# Altium schematic sheet TK2560_GSMWiFi.SchDoc
size A4
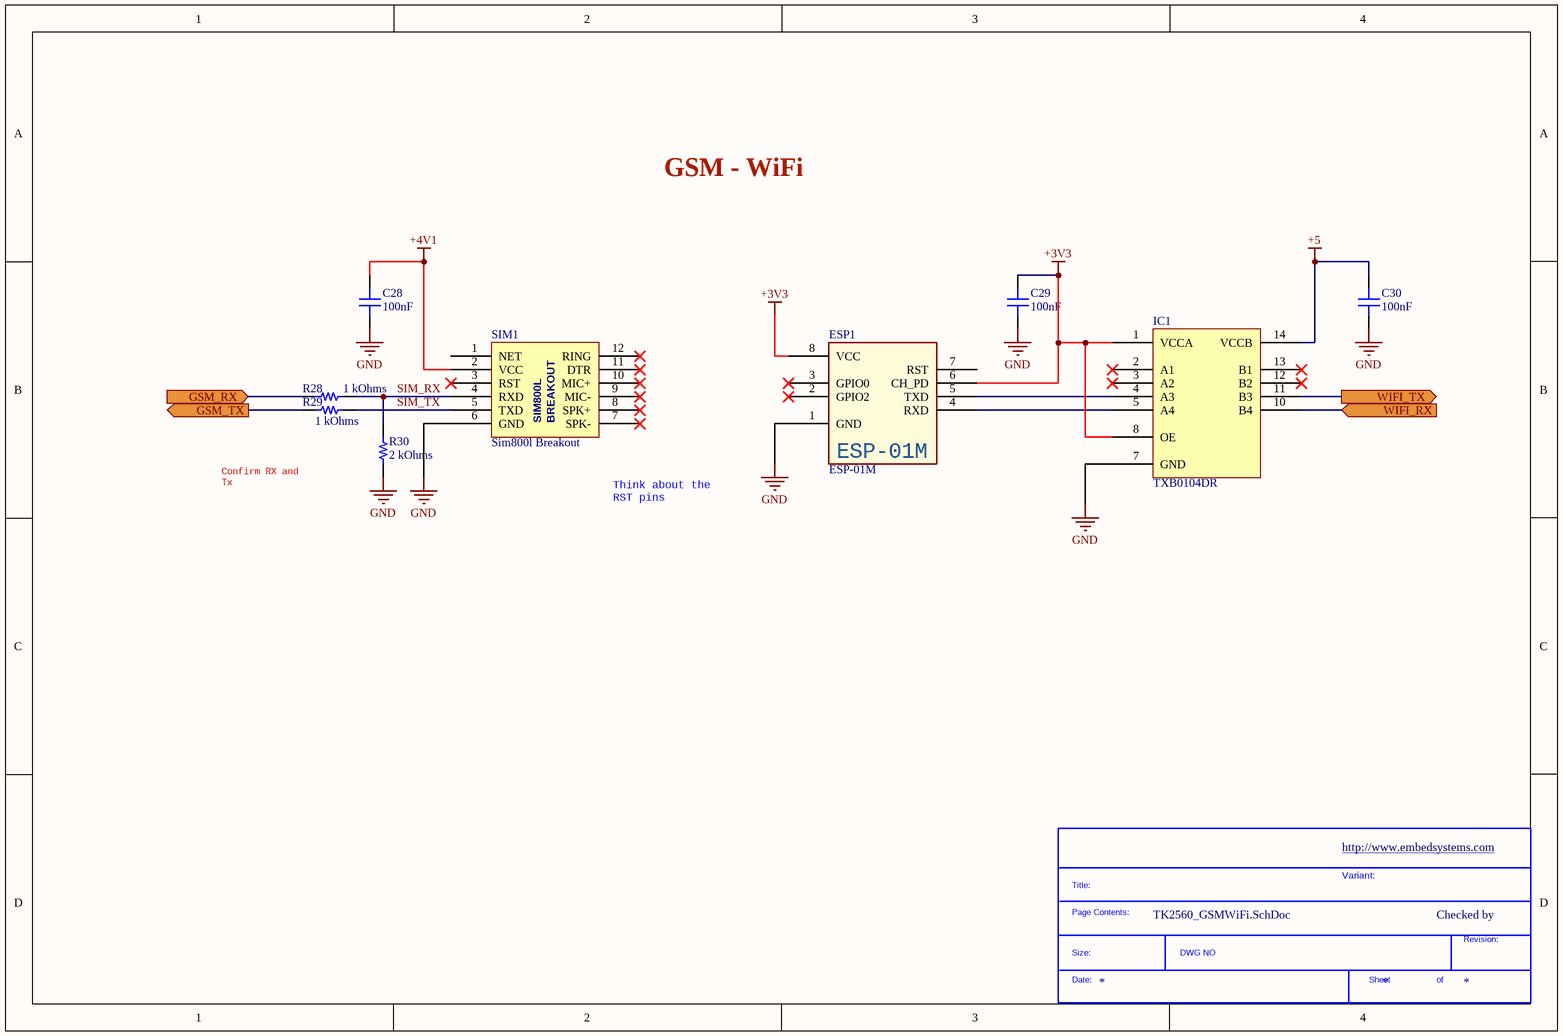
[diagram p0: TK2560_GSMWiFi.SchDoc]

## Parts
*?  SDTitleBlock  (value not drawn)  (graphical)
C28  100nF  [CAP 0805_2012]
C29  100nF  [CAP 0805_2012]
C30  100nF  [CAP 0805_2012]
ESP1  ESP-01M  [ESP-01]
IC1  TXB0104DR  [TI SOIC-14 D]
R28  1 kOhms  [RES 0805_2012]
R29  1 kOhms  [RES 0805_2012]
R30  2 kOhms  [RES 0805_2012]
SIM1  Sim800l Breakout  [SIM800L_BO]

## Ports
GSM_RX (in), GSM_TX (out), WIFI_RX (in), WIFI_TX (out)

## Nets
+3V3: C29.2 ESP1.6(CH_PD) ESP1.8(VCC) IC1.1(VCCA) IC1.8(OE)
+4V1: C28.2 SIM1.2(VCC)
+5: C30.2 IC1.14(VCCB)
GND: C28.1 C29.1 C30.1 ESP1.1(GND) IC1.7(GND) R30.1 SIM1.6(GND)
GSM_RX: R28.1 ; port GSM_RX
GSM_TX: R29.1 ; port GSM_TX
SIM_RX: R28.2 R30.2 SIM1.4(RXD)
SIM_TX: R29.2 SIM1.5(TXD)
WIFI_RX: IC1.10(B4) ; port WIFI_RX
WIFI_TX: IC1.11(B3) ; port WIFI_TX
NetESP1_4: ESP1.4(RXD) IC1.5(A4)
NetESP1_5: ESP1.5(TXD) IC1.4(A3)

Not connected (* = marked no-connect by the designer): ESP1 2(GPIO2)* 3(GPIO0)* 7(RST); IC1 2(A1)* 3(A2)* 12(B2)* 13(B1)*; SIM1 1(NET) 3(RST)* 7(SPK-)* 8(SPK+)* 9(MIC-)* 10(MIC+)* 11(DTR)* 12(RING)*

## Notes on the sheet
- GSM - WiFi
- Confirm RX and Tx
- Think about the RST pins
- http://www.embedsystems.com
- Variant:
- Checked by
- (in symbol SDTitleBlock) Title:; Page Contents:; Revision:; Size:; DWG NO; Date:; Sheet; of
- (in symbol Sim800l Breakout) SIM800L; BREAKOUT

## Library data of the parts
C28-C30 = AC0805KKX8R9BB104: CAP CER 0805 10% X8R 50V 100NF; Manufacturer: Yageo; Capacitance: 0.1µF; Part Number: AC0805KKX8R9BB104; Value: 100nF; Applications: Automotive; ComponentLink1Description: Datasheet; ComponentLink1URL: http://www.yageo.com/documents/recent/AC0805KKX8R9BB104.pdf; ComponentLink2Description: DigiKey Link; ComponentLink2URL: http://digikey.com/product-detail/en/yageo/AC0805KKX8R9BB104/311-4624-1-ND/9699550; Device Package: 0805 (2012 Metric); LastUpdated: 02/09/2020 01:04:20; Lifecycle Status: Active; Minimum Order: 1; Mounting Type: Surface Mount, MLCC; Operating Temperature: -55°C ~ 150°C; Package / Case: 0805 (2012 Metric); Packaging: TapeAndReel; PartId: 14076; Part Status: Active; Price: 0.06; Ratings: AEC-Q200; Series: AC; Size / Dimension: 0.079" L x 0.049" W (2.00mm x 1.25mm); Supplier 1: DigiKey; Supplier Part Number 1: 311-4624-1-ND; Temperature Coefficient: X8R; Thickness (Max): 0.057" (1.45mm); Tolerance: ±10%; Voltage - Rated: 50V
ESP1 = ESP-01M: TXRX ESP8266 MOD WIFI TRACE ANT; Manufacturer: Seeed Studio; Manufacturer Part Number: 317060016; RoHS: No; Category: Embedded Processors and Controllers; Stock 1: 190; Pricing 1: 1=7.09000 (USD); Case/Package: Module; Weight: 0.0625lb; Length: 3.25inch; Width: 2.25inch; Height: 0.25inch; ComponentLink1URL: https://media.digikey.com/pdf/Data%20Sheets/Seeed%20Technology/317060016_Web.pdf?src-supplier=Digi-Key; ComponentLink1Description: https://media.digikey.com/pdf/Data%20Sheets/Seeed%20Technology/317060016_Web.pdf?src-supplier=Digi-Key; Supplier 1: Digi-Key; Supplier Part Number 1: 1597-1145-ND
IC1 = TXB0104DR: IC TRNSLTR BIDIRECTIONAL 14SOIC; Manufacturer: Texas Instruments; Channels per Circuit: 4; Data Rate: 100Mbps; Number of Circuits: 1; Output Type: Tri-State, Non-Inverted; Translator Type: Voltage Level; Voltage - VCCA: 1.2V ~ 3.6V; Voltage - VCCB: 1.65V ~ 5.5V; Part Number: TXB0104DR; Channel Type: Bidirectional; ComponentLink1Description: Datasheet; ComponentLink1URL: http://www.ti.com/general/docs/suppproductinfo.tsp?distId=10&gotoUrl=http%3A%2F%2Fwww.ti.com%2Flit%2Fgpn%2Ftxb0104; ComponentLink2Description: DigiKey Link; ComponentLink2URL: http://digikey.com/product-detail/en/texas-instruments/TXB0104DR/296-21928-1-ND/1629281; Device Package: 14-SOIC (0.154", 3.90mm Width); Features: Auto-Direction Sensing; LastUpdated: 13/05/2020 17:06:13; Lifecycle Status: Active; Minimum Order: 1; Mounting Type: Surface Mount; Operating Temperature: -40°C ~ 85°C (TA); Package / Case: 14-SOIC (0.154", 3.90mm Width); Packaging: TapeAndReel; Part Status: Active; Price: 0.54; Series: -; Supplier 1: DigiKey; Supplier Part Number 1: 296-21928-1-ND; Supplier Device Package: 14-SOIC
R28 R29 = RNCS0805BKE1K00: RES 1K OHM 0.1% 1/10W 0805; Manufacturer: Stackpole Electronics Inc; Power (Watts): 0.1W, 1/10W; Temperature Coefficient: ±25ppm/°C; Part Number: RNCS0805BKE1K00; Value: 1 kOhms; ComponentLink1Description: Datasheet; ComponentLink1URL: https://www.seielect.com/catalog/sei-rncs_rnch.pdf; ComponentLink2Description: DigiKey Link; ComponentLink2URL: http://digikey.com/product-detail/en/stackpole-electronics-inc/RNCS0805BKE1K00/RNCS0805BKE1K00CT-ND/1800170; Composition: Thin Film; Device Package: 0805 (2012 Metric); Features: Anti-Corrosive, Automotive AEC-Q200, Moisture Resistant; Height - Seated (Max): 0.026" (0.65mm); LastUpdated: 02/09/2020 01:15:24; Lifecycle Status: Active; Minimum Order: 1; Number of Terminations: 2; Operating Temperature: -55°C ~ 155°C; Package / Case: 0805 (2012 Metric); Packaging: TapeAndReel; PartId: 27715; Part Status: Active; Price: 0.09; Ratings: AEC-Q200; Resistance: 1 kOhms; Series: RNCS; Size / Dimension: 0.079" L x 0.049" W (2.00mm x 1.25mm); Supplier 1: DigiKey; Supplier Part Number 1: RNCS0805BKE1K00CT-ND; Supplier Device Package: 0805; Tolerance: ±0.1%
R30 = RCS08052K00FKEA: RES SMD 2K OHM 1% 0.4W 0805; Manufacturer: Vishay Dale; Power (Watts): 0.4W, 2/5W; Temperature Coefficient: ±100ppm/°C; Part Number: RCS08052K00FKEA; Value: 2 kOhms; ComponentLink1Description: Datasheet; ComponentLink1URL: http://www.vishay.com/docs/20065/rcse3.pdf; ComponentLink2Description: DigiKey Link; ComponentLink2URL: http://digikey.com/product-detail/en/vishay-dale/RCS08052K00FKEA/541-2840-1-ND/5867133; Composition: Thick Film; Device Package: 0805 (2012 Metric); Features: Automotive AEC-Q200, Pulse Withstanding; Height - Seated (Max): 0.020" (0.50mm); LastUpdated: 02/09/2020 01:15:24; Lifecycle Status: Active; Minimum Order: 1; Number of Terminations: 2; Operating Temperature: -55°C ~ 155°C; Package / Case: 0805 (2012 Metric); Packaging: TapeAndReel; PartId: 27786; Part Status: Active; Price: 0.03; Ratings: AEC-Q200; Resistance: 2 kOhms; Series: RCS e3; Size / Dimension: 0.079" L x 0.049" W (2.00mm x 1.25mm); Supplier 1: DigiKey; Supplier Part Number 1: 541-2840-1-ND; Supplier Device Package: 0805; Tolerance: ±1%
SIM1 = Sim800l Breakout: Supplier1: Nerokas; ComponentLink1Description: Shop; ComponentLink1URL: https://store.nerokas.co.ke/index.php?route=product/product&product_id=1266